# Altium schematic sheet OPA134同向加法器.SchDoc
size A4
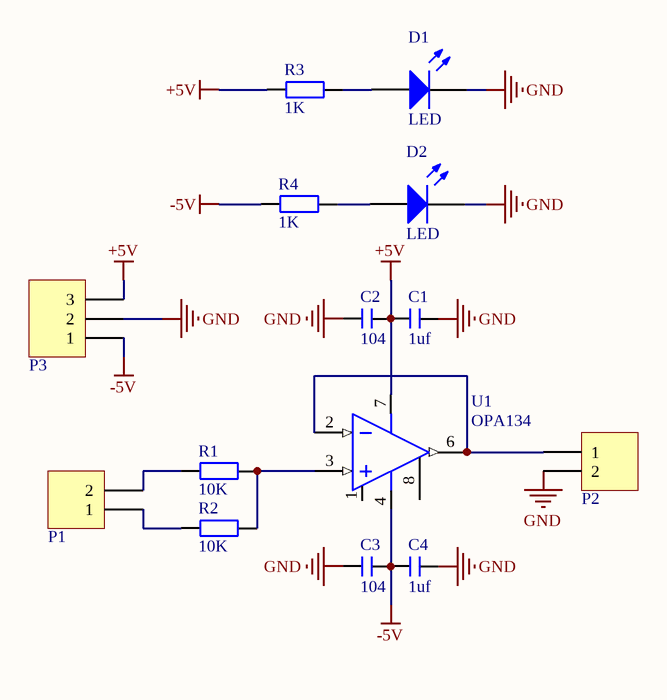
[diagram p0: OPA134同向加法器.SchDoc]

## Parts
C1  1uf  [C 0805]
C2  104  [C 0805]
C3  104  [C 0805]
C4  1uf  [C 0805]
D1  LED  [LED_0805]
D2  LED  [LED_0805]
P1  Header 2  [HDR2X1_B2]  (value not drawn)
P2  Header 2  [HDR2X1_B2]  (value not drawn)
P3  Header 3  [HDR3X1_B2]  (value not drawn)
R1  10K  [R 0603]
R2  10K  [R 0603]
R3  1K  [R 0805]
R4  1K  [R 0805]
U1  OPA134  [SOIC8_N]

## Nets
+5V: C1.1 C2.2 P3.3 R3.1 U1.7(V+)
-5V: C3.2 C4.1 P3.1 R4.1 U1.4(V-)
GND: C1.2 C2.1 C3.1 C4.2 D1.2(K) D2.2(K) P2.2 P3.2
NetD1_1: D1.1(A) R3.2
NetD2_1: D2.1(A) R4.2
NetP1_1: P1.1 R2.1
NetP1_2: P1.2 R1.1
NetP2_1: P2.1 U1.2(IN-) U1.6(OUT)
NetR1_2: R1.2 R2.2 U1.3(IN+)

Not connected (* = marked no-connect by the designer): U1 1(OFFSET_N1) 8(OFFSET_N2)

## Library data of the parts
C1-C4 = C: 无极性贴片电容; 版权归属: 源创客; BOM名称: 无极性贴片电容; 学习资源: www.ooocke.com
D1 D2 = LED: 发光二极管; Published: 8-Jun-2000; LatestRevisionDate: 08-Jul-2005; LatestRevisionNote: Mech Layer 1 removed.; PackageReference: LED; Publisher: Altium Limited
P1 P2 = Header 2: 接插件; LatestRevisionDate: 17-Jul-2002; LatestRevisionNote: Re-released for DXP Platform.; Publisher: Altium Limited
P3 = Header 3: 接插件; LatestRevisionDate: 17-Jul-2002; LatestRevisionNote: Re-released for DXP Platform.; Publisher: Altium Limited
R1-R4 = R: 贴片电阻; 版权归属: 源创客; BOM名称: 贴片电阻; 学习资源: www.ooocke.com
U1 = OPA134: 高性能音频运算放大器